# Altium schematic sheet GSM & SIM.SchDoc
size A3; SheetNumber: 3; SheetTotal: 3; SPICEModelCacheHHWAPIZZ: <root> / <DocumentId>HHWAPIZZ</DocumentId> / </root>
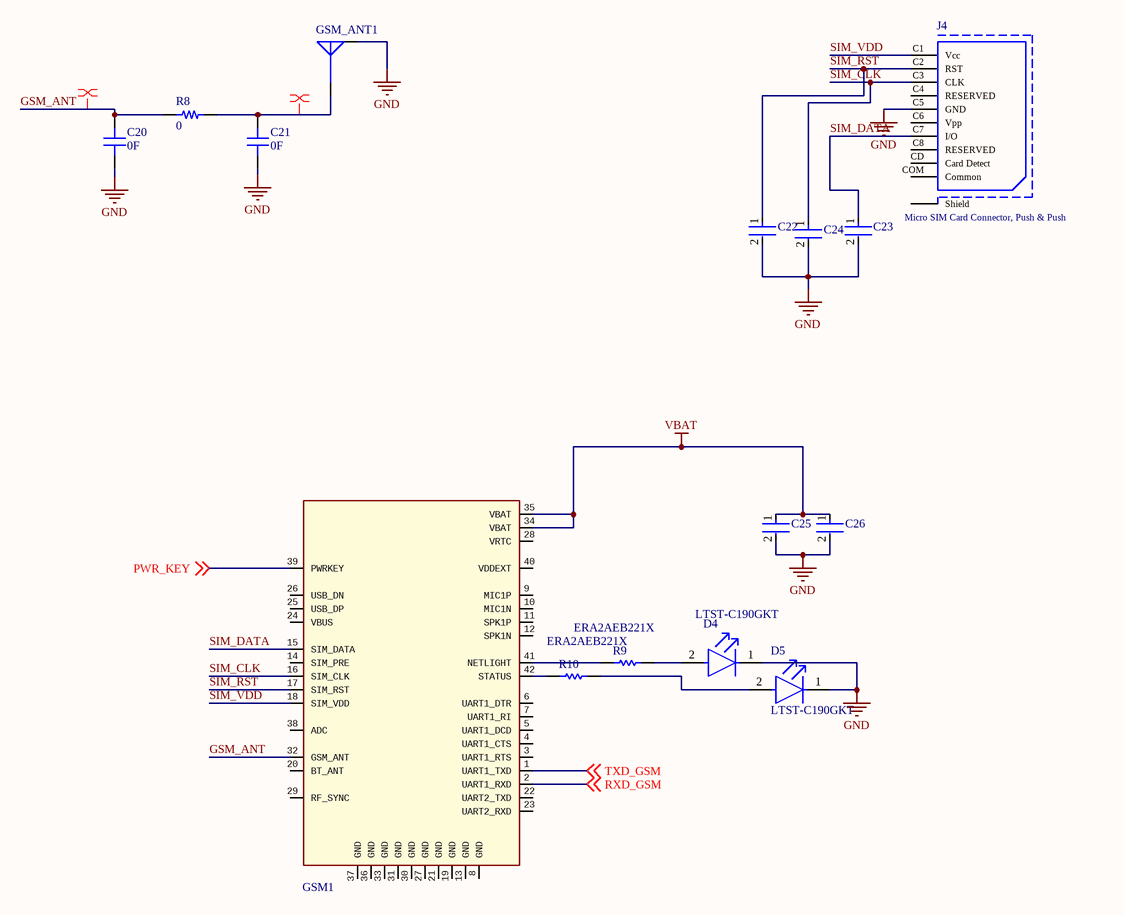
[diagram p0: GSM & SIM.SchDoc]

## Parts
C20  0F  [CAP 0402_1005]
C21  0F  [CAP 0402_1005]
C22  04023A330JAT2A  [FP-0402-L_1_0_1-W_0_5_0_1-IPC_A]  (value not drawn)
C23  04023A330JAT2A  [FP-0402-L_1_0_1-W_0_5_0_1-IPC_A]  (value not drawn)
C24  04023A330JAT2A  [FP-0402-L_1_0_1-W_0_5_0_1-IPC_A]  (value not drawn)
C25  04025A330JAT2A  [FP-0402-L_1_0_1-W_0_5_0_1-IPC_A]  (value not drawn)
C26  C1005C0G1H100D050BA  [FP-C1005-050-0_05-IPC_C]  (value not drawn)
D4  LTST-C190GKT  [FP-LTST-C190GKT-MFG]
D5  LTST-C190GKT  [FP-LTST-C190GKT-MFG]
GSM1  SIM800C  [Sim800C]  (value not drawn)
GSM_ANT1  UFL  [MOLEX SD-734120110]  (value not drawn)
J4  Micro SIM Card Connector, Push & Push  [693021010811]
R8  0  [RES 0402_1005]
R9  ERA2AEB221X  [RESC1005X40X25LL10T10]
R10  ERA2AEB221X  [RESC1005X40X25LL10T10]

## Nets
GND: C20.1 C21.1 C22.2 C23.2 C24.2 C25.2 C26.2 D4.1(C) D5.1(C) GSM_ANT1.G J4.C5(GND)
VBAT: C25.1 C26.1 GSM1.34(VBAT) GSM1.35(VBAT)
GSM_ANT: C20.2 GSM1.32(GSM_ANT) R8.1
PWR_KEY: GSM1.39(PWRKEY) ; off-sheet PWR_KEY
RXD_GSM: GSM1.2(UART1_RXD) ; off-sheet RXD_GSM
SIM_CLK: C24.1 GSM1.16(SIM_CLK) J4.C3(CLK)
SIM_DATA: C23.1 GSM1.15(SIM_DATA) J4.C7(I/O)
SIM_RST: C22.1 GSM1.17(SIM_RST) J4.C2(RST)
SIM_VDD: GSM1.18(SIM_VDD) J4.C1(Vcc)
TXD_GSM: GSM1.1(UART1_TXD) ; off-sheet TXD_GSM
NetC21_2: C21.2 GSM_ANT1.S R8.2
NetD4_2: D4.2(A) R9.2
NetD5_2: D5.2(A) R10.2
NetGSM1_41: GSM1.41(NETLIGHT) R9.1
NetGSM1_42: GSM1.42(STATUS) R10.1

Not connected (* = marked no-connect by the designer): GSM1 3(UART1_RTS) 4(UART1_CTS) 5(UART1_DCD) 6(UART1_DTR) 7(UART1_RI) 8(GND) 9(MIC1P) 10(MIC1N) 11(SPK1P) 12(SPK1N) 13(GND) 14(SIM_PRE) 19(GND) 20(BT_ANT) 21(GND) 22(UART2_TXD) 23(UART2_RXD) 24(VBUS) 25(USB_DP) 26(USB_DN) 27(GND) 28(VRTC) 29(RF_SYNC) 30(GND) 31(GND) 33(GND) 36(GND) 37(GND) 38(ADC) 40(VDDEXT); J4 C4(RESERVED) C6(Vpp) C8(RESERVED) CD(Card_Detect) COM(Common) Shield

## Layout directives
net class GSM_ANT; rule Width Constraint [Pref Impedance = 50.00ohms    Min Impedance = 50.00ohms    Max Impedance = 50.00ohms]: GSM_ANT
net class GSM_ANT: NetC21_2

## Library data of the parts
C20 C21 = Cap 0402: SMT Capacitor; VALUE: 100nF
C22-C24 = CMP-2008-02494-2: General Purpose Ceramic Capacitor, 0402, 33pF, 5%, C0G, 30ppm/°C, 25V; Case Code (Imperial): 0402; Capacitance: 33pF; Thickness: 0.022inch; Series: -; Min Operating Temperature: -55°C; Radiation Hardening: No; Lead Free: Lead Free; Voltage Rating (DC): 25V; RoHS Compliant: Yes; Dielectric: C0G; Width: 0.02inch; Package Quantity: 10000; Number of Pins: 2; Mount: Surface Mount; Packaging: Tape and Reel; Case/Package: 0402; Construction: Flat; Depth: 0.5mm; Length: 1mm; Voltage Rating: 25V; Max Operating Temperature: 125°C; Termination: SMD/SMT; Case Code (Metric): 1005; Tolerance: 5%
C25 = CMP-2008-02637-2: General Purpose Ceramic Capacitor, 0402, 33pF, 5%, C0G, 30ppm/°C, 50V; Insulation Resistance: 100GR; REACH SVHC: No SVHC; Radiation Hardening: No; Voltage Rating (DC): 50V; Tolerance: 5%; Voltage Rating: 50V; Mount: Surface Mount; Packaging: Tape and Reel; Construction: Flat; Voltage: 50V; Case/Package: 0402; Temperature Coefficient: 30ppm/°C; Lead Free: Lead Free; Case Code (Metric): 1005; Number of Pins: 2; Min Operating Temperature: -55°C; Capacitance: 33pF; Width: 0.5mm; Dielectric: C0G; Height: 0.5mm; Thickness: 0.022inch; Contact Plating: Tin; Length: 1mm; Package Quantity: 1; Depth: 0.5mm; Termination: SMD/SMT; Max Operating Temperature: 125°C; RoHS Compliant: Yes; Case Code (Imperial): 0402; Series: -
C26 = CMP-08246-002674-1: CAP CER 10PF 50V C0G 0402; Temperature Coefficient: 30ppm/°C; Dielectric Material: Ceramic; Termination: SMD/SMT; Width: 0.02inch; Case Code (Metric): 1005; Thickness: 0.022inch; Height: 0.5mm; REACH SVHC: No SVHC; Case Code (Imperial): 0402; Voltage: 50V; Capacitance: 10pF; Max Operating Temperature: 125°C; Length: 1mm; Construction: Flat; Packaging: Tape and Reel; Lead Free: Lead Free; Series: C; Depth: 0.5mm; Dielectric: C0G; Package Quantity: 1; Mount: Surface Mount; Voltage Rating (DC): 50V; Voltage Rating: 50V; Case/Package: 0402; RoHS Compliant: Yes; Min Operating Temperature: -55°C; Number of Pins: 2; Radiation Hardening: No; Weight: 2.3E-05oz
D4 D5 = CMP-22017-000005-2: LED GREEN CLEAR CHIP SMD; Dominant Wavelength: 569nm; Reverse Voltage: 5V; Lens Color: Colorless; Viewing Angle: 130°; Voltage: 2V; Forward Current: 30mA; Power Dissipation: 100mW; Luminous Intensity: 6mcd; Number of LEDs: 1; Forward Voltage: 2.1V; Wavelength: 565nm; Test Current: 10mA; Min Operating Temperature: -55°C; Lens Style: Clear; Mount: Surface Mount; Width: 0.8mm; Packaging: Tape and Reel; Lens Transparency: Clear; Case Code (Metric): 1608; Depth: 0.8mm; Case Code (Imperial): 0603; Case/Package: 0603; Number of Pins: 2; Max Operating Temperature: 85°C; Lead Free: Lead Free; Number of Elements: 1; Length: 1.6mm; Height: 0.8mm; Package Quantity: 1; Power Rating: 100mW; Radiation Hardening: No; Illumination Color: Green; Color: Green
GSM_ANT1 = UFL MOLEX SD-734120110: PartNumber: MOLEX SD-734120110
J4 = Micro SIM Card 693021010811: WR-CRD Micro SIM Card Connector, Push & Push, with Card Detection; Rated Current: 1A; Working Voltage: 500V AC; ComponentLink1Description: Manufacturer; ComponentLink1URL: http://www.we-online.de; ComponentLink2Description: Datasheet; ComponentLink2URL: http://katalog.we-online.de/em/datasheet/693021010811.pdf; PartNumber: 693021010811; Published Date: Feb. 2018; Publisher: Wurth Elektronik; Operating Temperature: -25 to 85 degC; Mounting Technology: SMT
R8 = Res 0402: SMT Resistor; VALUE: 1K
R9 R10 = CMP-2002-05880-1: Manufacturer: Panasonic; Part Number: ERA2AEB221X